# EAGLE board 612_jetracer_esp32s3_030004 (EAGLE 9.6.2)
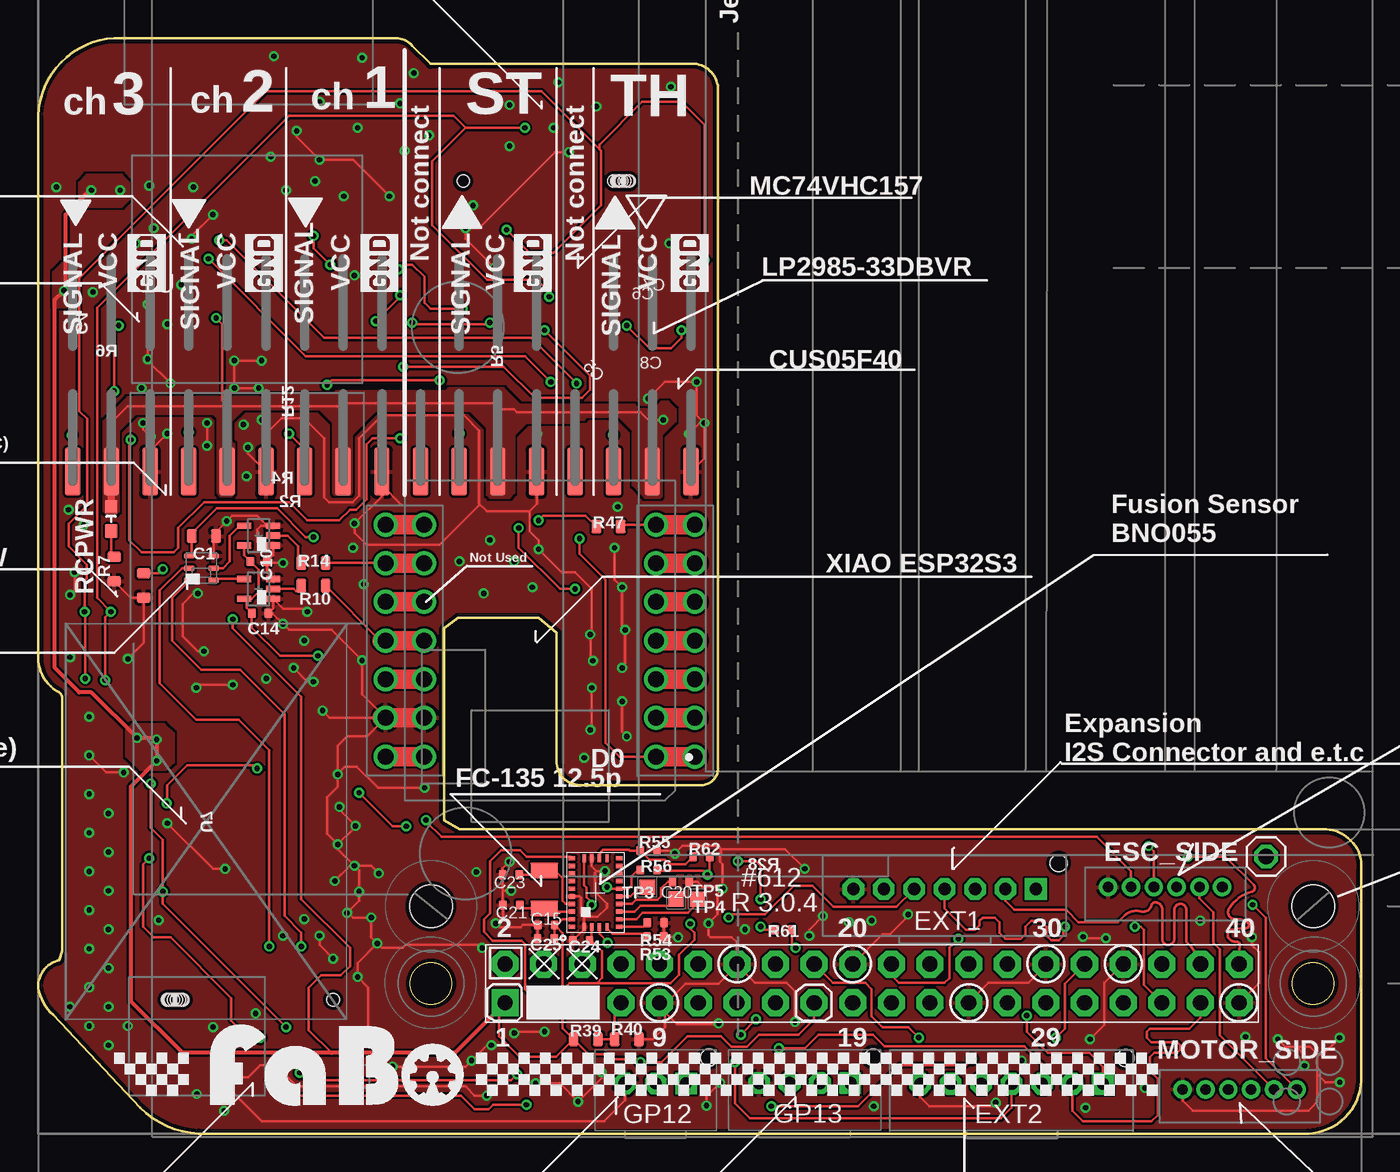
[diagram p5: board, top side]
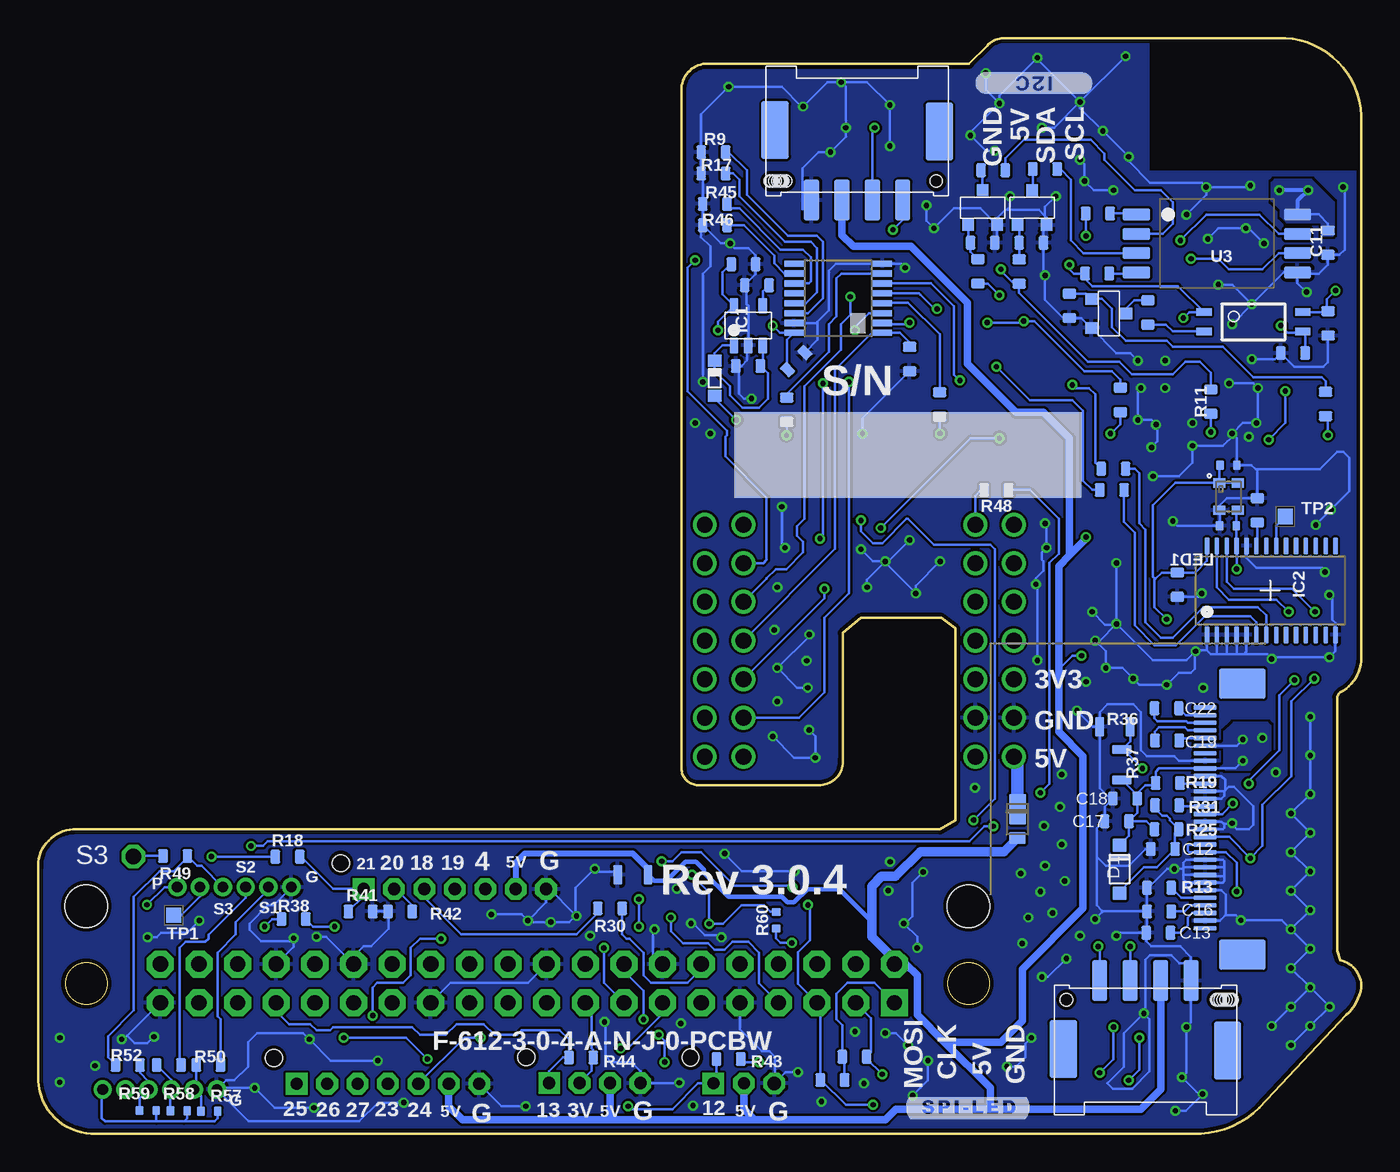
[diagram p6: board, bottom side, seen from below]

Size 87.01 x 72 mm. Coordinates in mm from the lower left corner, seen from the top.
Outline: 44.71,24.1 44.71,68.4 arc84 43.31,70.3 25.81,70.3 24.61,71.5 arc50 23.41,72 5.51,72 arc90 0.01,66.9 0.01,31.5 arc67 1.41,29 1.51,28.9 1.61,28.7 1.61,12 1.41,11.4 arc80 0.01,9.6 arc39 1.01,7.8 6.71,1.7 arc48 11.11,0 83.51,0 arc90 87.01,3.8 87.01,17.4 arc90 84.71,20 27.71,20 26.71,20.6 26.71,33.2 27.61,33.9 32.91,33.9 34.11,32.9 34.11,24.6 arc99 35.71,22.9 43.61,22.9 arc95 44.71,24.1
Copper layers (1*16): Top 0.035mm / dielectric 1.6mm / Bottom 0.035mm
Design rules "PCBway": minimum track width 6mil, minimum drill 12mil, track to track 6mil, track to pad 6mil, pad to pad 6mil, via to via 6mil, smd to smd 6mil, copper to edge 10mil, drill to drill 10mil, minimum pad ring 10mil, minimum via ring 6mil, stop-mask expansion 2mil, vias tented up to drill 100mil, thermal gap 8mil
Holes 2.8 mm at 83.84,14.95 25.84,14.94
tKeepout: area 1.5,7.4 to 20.4,33.3; area -2.5,41.7 to 45.4,72.2
bRestrict: area -0.8,63.3 to 13.9,85.7; 9 lines

## Footprints (pad centres in the part's own frame; a part is rotated, then mirrored left to right if it is on the bottom)
0603 = smd 0.65 x 0.9: 1 -0.8,0; 2 0.8,0
0402 = smd 0.5 x 0.6: 1 -0.55,0; 2 0.55,0
1N4148W = smd 0.9 x 0.95: ANODE 0,0; CATHODE 3.15,0
CUS05F40 = smd 0.8 x 0.9: A -1.15,0; C 1.15,0
US2H = smd 0.8 x 1.1: A 1.25,0 | smd 2 x 1.1: K -0.65,0
B6B-ZR = drill 0.7 pad 1.016: 1 -3.75,0; 2 -2.25,0; 3 -0.75,0; 4 0.75,0; 5 2.25,0; 6 3.75,0
SPI-B07B-PASK-1 = drill 0.8 pad 1.422 octagon: 1 -6,1.27; 2 -4,1.27; 3 -2,1.27; 4 0,1.27; 5 2,1.27; 6 4,1.27 | drill 0.8 pad 1.422 square: 7 6,1.27 | hole 1.1: 7.5,2.97
FABO_BRICK_3PIN_B03B-PASK-1 = drill 0.9 pad 1.422 octagon: GND -2,0 | drill 0.8 pad 1.422 square: I/O 2,0 | drill 0.8 pad 1.422 octagon: VCC 0,0 | hole 1.1: 3.5,1.7
GPIO-B04B-PASK-1 = drill 0.8 pad 1.422 octagon: 3V3 1,0.02; 5V -1,0.02; GND -3,0.02 | drill 0.8 pad 1.422 square: IO 3,0.02 | hole 1.1: 4.5,1.72
JETSON_NANO_DEMENTION = drill 1 pad 1.778 square: 1 0,0 | drill 1 pad 1.778 octagon: 2 0,2.54; 3 2.54,0; 4 2.54,2.54; 5 5.08,0; 6 5.08,2.54; 7 7.62,0; 8 7.62,2.54; 9 10.16,0; 10 10.16,2.54; 11 12.7,0; 12 12.7,2.54; 13 15.24,0; 14 15.24,2.54; 15 17.78,0; 16 17.78,2.54; 17 20.32,0; 18 20.32,2.54; 19 22.86,0; 20 22.86,2.54; 21 25.4,0; 22 25.4,2.54; 23 27.94,0; 24 27.94,2.54; 25 30.48,0; 26 30.48,2.54; 27 33.02,0; 28 33.02,2.54; 29 35.56,0; 30 35.56,2.54; 31 38.1,0; 32 38.1,2.54; 33 40.64,0; 34 40.64,2.54; 35 43.18,0; 36 43.18,2.54; 37 45.72,0; 38 45.72,2.54; 39 48.26,0; 40 48.26,2.54
I2C-SM04B-PASS-1-FL = smd 1 x 2.7: 5V -1,0; GND -3,0; SCL 3,0; SDA 1,0 | smd 1.8 x 3.8: P$5 -5.4,4.6; P$6 5.4,4.5 | hole 0.8: 5.2,1.25; -4.7,1.25; -5.7,1.25; -5.6,1.25; -5.4,1.25; -5.2,1.25; -5.1,1.25; -5,1.25; -4.9,1.25
SOT-23-5 = smd 0.6 x 1.05: 1 -0.95,-1.3; 2 0,-1.3; 3 0.95,-1.3; 4 0.95,1.3; 5 -0.95,1.3
PCA9685 = smd 0.3 x 1.1: 1 -4.15,-2.93; 2 -3.5,-2.93; 3 -2.85,-2.93; 4 -2.2,-2.93; 5 -1.55,-2.93; 6 -0.9,-2.93; 7 -0.25,-2.93; 8 0.4,-2.93; 9 1.05,-2.93; 10 1.7,-2.93; 11 2.35,-2.93; 12 3,-2.93; 13 3.65,-2.93; 14 4.3,-2.93; 15 4.3,2.92; 16 3.65,2.92; 17 3,2.92; 18 2.35,2.92; 19 1.7,2.92; 20 1.05,2.92; 21 0.4,2.92; 22 -0.25,2.92; 23 -0.9,2.92; 24 -1.55,2.92; 25 -2.2,2.92; 26 -2.85,2.92; 27 -3.5,2.92; 28 -4.15,2.92
APA102_2020 = smd 0.7 x 0.35: CKI 0.8,0; CKO -0.8,0; GND 0.8,0.8; SDI 0.8,-0.8; SDO -0.8,-0.8; VCC -0.8,0.8
SUPERSOT-3 = smd 0.76 x 0.76: D 0,1.15; G -0.95,-1.15; S 0.95,-1.15
0805 = smd 0.6 x 1.3: 1 -1,0; 2 1,0
0603' = smd 0.9 x 0.8: ANODE -0.8,0; CATHODE 0.8,0
1X01 = drill 1.016 octagon: 1 0,0
SPI-SM04B-PASS-1-FL = smd 1 x 2.7: 5V -1,-0.1; CI 1,-0.1; DI 3,-0.1; GND -3,-0.1 | smd 1.8 x 3.8: P$5 -5.4,4.5; P$6 5.4,4.4 | hole 0.8: 5.2,1.15; -4.7,1.15; -5.7,1.15; -4.8,1.15; -4.9,1.15; -5.1,1.15; -5.3,1.15; -5.5,1.15; -5.6,1.15
TESTPOINT_SMD-10SN = smd 1 x 1: TP 0,0
11-3C1 = smd 1 x 0.5: 1 -3.24,0.635; 2 -3.24,-0.635; 3 3.24,-0.635; 4 3.24,0.635
MOUDLE14P-DIP = drill 1.05: P$1 1.27,18.12; P$2 1.27,15.58; P$3 1.27,13.04; P$4 1.27,10.5; P$5 1.27,7.96; P$6 1.27,5.42; P$7 1.27,2.88; P$8 16.51,2.88; P$9 16.51,5.42; P$10 16.51,7.96; P$11 16.51,10.5; P$12 16.51,13.04; P$13 16.51,15.58; P$14 16.51,18.12; P$15 -1.27,18.12; P$16 -1.27,15.58; P$17 -1.27,13.04; P$18 -1.27,10.5; P$19 -1.27,7.96; P$20 -1.27,5.42; P$21 -1.27,2.88; P$22 19.05,2.88; P$23 19.05,5.42; P$24 19.05,7.96; P$25 19.05,10.5; P$26 19.05,13.04; P$27 19.05,15.58; P$28 19.05,18.12
TLP2270 = smd 0.8 x 1.8: 1 -1.905,-5.3; 2 -0.635,-5.3; 3 0.635,-5.3; 4 1.905,-5.3; 5 1.905,5.3; 6 0.635,5.3; 7 -0.635,5.3; 8 -1.905,5.3
ER-CON30HT-1 = smd 0.3 x 1.5 bottom: 1 7,-0.23; 2 6.5,-0.23; 3 6,-0.23; 4 5.5,-0.23; 5 5,-0.23; 6 4.5,-0.23; 7 4,-0.23; 8 3.5,-0.23; 9 3,-0.23; 10 2.5,-0.23; 11 2,-0.23; 12 1.5,-0.23; 13 1,-0.23; 14 0.5,-0.23; 15 0,-0.23; 16 -0.5,-0.23; 17 -1,-0.23; 18 -1.5,-0.23; 19 -2,-0.23; 20 -2.5,-0.23; 21 -3,-0.23; 22 -3.5,-0.23; 23 -4,-0.23; 24 -4.5,-0.23; 25 -5,-0.23; 26 -5.5,-0.23; 27 -6,-0.23; 28 -6.5,-0.23; 29 -7,-0.23; 30 -7.5,-0.23 | smd 2 x 3 bottom: 31 -9.07,-2.67; 32 8.74,-2.67
PNHEADER_2.54_SMT_17PIN_RC_TT01_02 = smd 1.02 x 3.17: 1:SIGNAL3 -20.32,0; 2:VCC3 -17.78,0; 3:GND3 -15.24,0; 4:SIGNAL2 -12.7,0; 5:VCC2 -10.16,0; 6:GND2 -7.62,0; 7:SIGNAL1 -5.08,0; 8:VCC1 -2.54,0; 9:GND1 0,0; 10:NC1 2.54,0; 11:ST_SIGNAL 5.08,0; 12:ST_VCC 7.62,0; 13:ST_GND 10.16,0; 14:NC2 12.7,0; 15:TH_SINGNAL 15.24,0; 16:TH_VCC 17.78,0; 17:TH_GND 20.32,0
MC74VHC157_TSSOP-16 = smd 1.26 x 0.36: 1 -2.9,2.275; 2 -2.9,1.625; 3 -2.9,0.975; 4 -2.9,0.325; 5 -2.9,-0.325; 6 -2.9,-0.975; 7 -2.9,-1.625; 8 -2.9,-2.275; 9 2.9,-2.275; 10 2.9,-1.625; 11 2.9,-0.975; 12 2.9,-0.325; 13 2.9,0.325; 14 2.9,0.975; 15 2.9,1.625; 16 2.9,2.275
SOT-1DOT1 = smd 0.4 x 0.95: 1 -0.65,-0.95; 2 0,-0.95; 3 0.65,-0.95; 4 0.65,0.95; 5 -0.65,0.95
KC2016Z = smd 0.6 x 0.8: #1 -0.9,-0.6; #2 0.9,-0.6; #3 0.9,0.6; #4 -0.9,0.6
LGA = smd 0.25 x 0.475: 1 -2.25,1.562; 6 -2.25,-1.562; 7 -1.75,-1.562; 8 -1.25,-1.562; 9 -0.75,-1.562; 10 -0.25,-1.562; 11 0.25,-1.562; 12 0.75,-1.562; 13 1.25,-1.562; 14 1.75,-1.562; 15 2.25,-1.562; 20 2.25,1.562; 21 1.75,1.562; 22 1.25,1.562; 23 0.75,1.562; 24 0.25,1.562; 25 -0.25,1.562; 26 -0.75,1.562; 27 -1.25,1.562; 28 -1.75,1.562 | smd 0.475 x 0.25: 2 -2.263,0.75; 3 -2.263,0.25; 4 -2.263,-0.25; 5 -2.263,-0.75; 16 2.263,-0.75; 17 2.263,-0.25; 18 2.263,0.25; 19 2.263,0.75
FC-135 = smd 1 x 1.8: 1 -1.25,0; 2 1.25,0

## Placement (x,y rotation side)
C1  10uF  [0603]  10.91,39.27 180 top
C2  0.1uF  [0603]  12.1,36.07 90 bottom
C3  20pF  [0402]  8.78,39.94 0 bottom
C4  0.1uF  [0603]  2.21,53.25 90 bottom
C5  0.1uF  [0603]  37.17,50.77 225 bottom
C6  0.01uF  [0603]  39.75,55.76 0 bottom
C7  2.2uF  [0603]  40.63,57.13 180 bottom
C8  1uF  [0603]  40.33,50.44 0 bottom
C9  10uF  [0402]  8.75,43.93 180 bottom
C10  0.1uF  [0402]  14.51,37.6 180 top
C11  0.1uF  [0603]  2.21,58.55 90 bottom
C12  10uF  [0603]  13.06,18.7 0 bottom
C13  10uF  [0603]  13.36,13.2 0 bottom
C14  0.1uF  [0402]  14.61,34.2 180 top
C15  0.1uF  [0402]  33.41,13.71 0 top
C16  10uF  [0603]  13.31,14.6 0 bottom
C17  1uF  [0603]  16.09,20.53 0 bottom
C18  1uF  [0603]  15.55,22.02 0 bottom
C19  1uF  [0603]  12.78,25.83 180 bottom
C20  0.1uF  [0402]  42.27,16.55 180 top
C21  22pF  [0402]  31.12,15.02 180 top
C22  1uF  [0603]  12.81,27.95 0 bottom
C23  22pF  [0402]  31.1,17 180 top
C24  0.1uF  [0402]  35.71,12.68 0 top
C25  0.1uF  [0402]  33.4,12.8 0 top
D1  1N4148  [1N4148W]  15.91,15.8 90 bottom
D2  CUS05F40  [CUS05F40]  42.52,49.65 90 bottom
D3  CUHS20S30  [US2H]  22.62,20.67 270 bottom
ESC_CON  BRUSHLESSMOTOR_CON  [B6B-ZR]  74.11,16.2 0 top
EXT1  FABO-I2S-7PIN  [SPI-B07B-PASK-1]  59.61,14.8 0 top
EXT2  FABO-SPI-7PIN  [SPI-B07B-PASK-1]  64.01,2 0 top
GP12  [FABO_BRICK_3PIN_B03B-PASK-1]  40.61,3.3 0 top
GP13  FABO-GPIO-2G  [GPIO-B04B-PASK-1]  50.41,3.3 0 top
GPIO40  JETSON_NANOJETSON_NANO_OVERALL  [JETSON_NANO_DEMENTION]  30.71,8.6 0 top
I2C  FABO-I2C  [I2C-SM04B-PASS-1-FL]  33.16,61.35 0 bottom
IC1  [SOT-23-5]  40.31,53.1 0 bottom
IC2  [PCA9685]  6.01,35.7 0 bottom
LED1  [APA102_2020]  10.75,37.16 0 top
MOTOR  BRUSHLESSMOTOR_CON  [B6B-ZR]  79.01,2.9 0 top
Q3  MOSFET-N_FDN335N  [SUPERSOT-3]  16.61,53.9 270 bottom
Q4  MOSFET-N_FDN335N  [SUPERSOT-3]  21.66,60.85 0 bottom
Q5  MOSFET-N_FDN335N  [SUPERSOT-3]  24.91,60.85 0 bottom
R1  DNP  [0603]  6.95,36.03 90 top
R2  220  [0603]  16.41,42.3 180 bottom
R3  0  [0603]  6.86,40.96 270 bottom
R4  220  [0603]  16.31,43.7 180 bottom
R5  100K  [0603]  29.71,50.9 90 bottom
R6  4.7K  [0603]  4.51,51.3 180 bottom
R7  1K  [0603]  5.01,37.1 90 top
R8  470  [0603]  2.36,47.95 270 bottom
R9  10K  [0603]  42.61,64.5 0 bottom
R10  0  [0603]  18.11,36 180 top
R11  22  [0603]  9.91,48.1 90 bottom
R12  22  [0603]  15.86,48.22 90 bottom
R13  390K  [0603]  13.31,16.15 180 bottom
R14  0  [0603]  18.11,37.5 180 top
R15  330  [0603]  17.38,56.52 180 bottom
R16  330  [0603]  17.33,60.47 180 bottom
R17  10K  [0603]  42.61,63.1 0 bottom
R18  51  [0603]  70.61,18.2 0 bottom
R19  10K  [0603]  12.74,23.03 0 bottom
R20  27  [0603]  27.73,47.92 270 bottom
R21  27  [0603]  37.78,47.57 270 bottom
R22  DNF  [0603]  34.78,3.52 0 bottom
R23  DNF  [0603]  33.34,5.05 180 bottom
R24  100K  [0603]  19.21,54.4 270 bottom
R25  10K  [0603]  12.81,20 0 bottom
R26  180  [0603]  14.05,53.96 90 bottom
R27  330  [0603]  20.81,63.4 180 bottom
R28  510  [0805]  47.91,17 0 bottom
R29  330  [0603]  24.22,63.31 180 bottom
R30  51  [0603]  49.41,14.8 180 bottom
R31  100  [0603]  12.78,21.58 0 bottom
R32  100K  [0603]  24.91,58.55 0 bottom
R33  100K  [0603]  21.71,58.55 0 bottom
R34  470  [0603]  25.21,56.67 90 bottom
R35  470  [0603]  22.51,56.65 90 bottom
R36  0/0805  [0805]  16.21,26.75 0 bottom
R37  DNP  [0805]  15.76,24.25 270 bottom
R38  51  [0603]  70.21,14.1 0 bottom
R39  DNF  [0603]  36.01,6.2 0 top
R40  DNF  [0603]  38.71,6.2 0 top
R41  100K  [0603]  65.81,14.6 0 bottom
R42  100K  [0603]  63.21,14.6 180 bottom
R43  DNF  [0603]  41.61,4.9 180 bottom
R44  DNF  [0603]  51.31,5 180 bottom
R45  10K  [0603]  42.51,61.1 0 bottom
R46  10K  [0603]  42.51,59.7 0 bottom
R47  0  [0603]  37.51,39.9 0 top
R48  0  [0603]  24.01,42.3 180 bottom
R49  0  [0603]  77.99,18.25 180 bottom
R50  0  [0603]  75.81,4.5 0 bottom
R51  0  [0603]  78.41,4.5 0 bottom
R52  0  [0603]  81.11,4.5 180 bottom
R53  10K  [0402]  40.59,12.94 180 top
R54  10K  [0402]  40.61,13.86 180 top
R55  10K  [0402]  40.15,18.6 180 top
R56  10K  [0402]  40.15,17.32 0 top
R57  DNP  [0402]  75.75,1.47 0 bottom
R58  DNP  [0402]  77.76,1.51 0 bottom
R59  DNP  [0402]  79.79,1.52 0 bottom
R60  10K  [0402]  38.48,14.02 90 bottom
R61  10K  [0402]  49.01,13.4 180 top
R62  DNP  [0402]  43.61,18.2 0 top
RCPWR  ORANGE  [0603']  4.81,40.4 270 top
S3  [1X01]  80.74,18.21 0 top
SPI-LED  [SPI-SM04B-PASS-1-FL]  14.21,9.95 180 bottom
TP1  TESTPOINT_TPS-SMD-10SN  [TESTPOINT_SMD-10SN]  78.1,14.35 0 bottom
TP2  TESTPOINT_TPS-SMD-10SN  [TESTPOINT_SMD-10SN]  5.01,40.56 0 bottom
TP3  TESTPOINT_TPS-SMD-10SN  [TESTPOINT_SMD-10SN]  40.05,16.2 0 top
TP4  TESTPOINT_TPS-SMD-10SN  [TESTPOINT_SMD-10SN]  43.36,15.41 0 top
TP5  TESTPOINT_TPS-SMD-10SN  [TESTPOINT_SMD-10SN]  41.94,15.42 0 top
U1  TLP291A  [11-3C1]  7.11,53.35 0 bottom
U2  [MOUDLE14P-DIP]  41.91,42.9 180 top
U3  [TLP2270]  9.51,58.5 270 bottom
U7  [ER-CON30HT-1]  10.51,20.5 270 top
U$1  RC_17PIN_OUTIN  [PNHEADER_2.54_SMT_17PIN_RC_TT01_02]  22.61,43.5 0 top
U$2  [LOGO_FABO_L]  18.96,1.84 0 top
U$3  MC74VHC157  [MC74VHC157_TSSOP-16]  34.4,54.9 180 bottom
U$5  [LOGO_SILK_GND]  16.11,55.3 90 top
U$6  [LOGO_SILK_GND]  23.71,55.3 90 top
U$7  [LOGO_SILK_GND]  33.81,55.3 90 top
U$8  [LOGO_SILK_GND]  44.11,55.3 90 top
U$9  SN74AHCT1G125  [SOT-1DOT1]  14.51,35.8 90 top
U$10  SN74AHCT1G125  [SOT-1DOT1]  14.51,39.3 90 top
U$11  KC2016Z  [KC2016Z]  8.74,41.86 270 bottom
U$12  [LOGO_SILK_GND]  8.41,55.3 90 top
U$13  BNO055  [LGA]  36.66,15.84 90 top
X1  FC-135  [FC-135]  33.29,16.05 90 top

## Tracks (layer width: path | path; a pad name or v marks a point on that pad's centre or on a via)
3V3_JETSON  (via drill 0.35)
  Top 0.152: GPIO40.1 30.31,8.2 30.31,6.4 31.66,5.05 34.06,5.05 R39.1 | v12.81,33.8 12.81,33.2 17.31,28.7 17.31,15.4 20.51,12.2 20.51,11 19.91,10.4 18.61,10.4 17.81,9.6 17.81,6.8 19.31,5.3 | R39.1 36.21,5.2 37.21,5.2 37.51,4.9 39.41,4.9 v39.61,4.7 41.01,4.7 42.71,6.4 44.91,6.4 45.61,5.7 46.61,5.7 47.41,6.5 50.01,6.5 51.03,7.52 GPIO40.17 | C15.2 34.12,13.71 34.5,14.09 U$13.28 | C15.2 34.05,13.62 | 34.05,13.62 34.49,13.18 34.49,9.41 | R39.1 34.49,6.92 34.49,9.41 | 34.49,9.41 34.96,9.88 36.75,9.88 | 36.75,9.88 41.6,9.88 42.16,10.44 42.16,11.76 43.15,12.75 43.15,13.2 42.88,13.46 v42.88,13.79 | 33.95,13.51 34.05,13.62 | C25.2 C15.2 | 36.75,9.88 37.1,10.23 37.1,11.97 36.39,12.68 C24.2 36.41,12.83 U$13.3 | 43.91,17.11 43.76,17.26 40.76,17.26 R56.2 | 43.91,17.11 v44.02,17.01 | R62.2 44.16,17.35 43.91,17.11
  Top 0.254: GPIO40.1 27.41,5.3 19.31,5.3 9.5,5.3 6.11,8.7 6.11,22.8 v7.81,24.5 v7.81,25.9 7.71,26 v6.51,26 3.51,29 2.71,29 1.11,30.6 1.11,54.8 v1.71,55.4 1.81,55.5 1.81,60.4 3.46,62.05 v3.51,62
  Bottom 0.152: U3.8 2.81,60.41 2.21,59.8 C11.2 | 3.83,54.02 U1.4 2.27,53.99 | R22.2 33.98,4.9 R23.2 34.14,7.13 34.51,7.5 34.51,9.2 33.81,9.9 32.01,9.9 GPIO40.1 | U$11.#4 U$11.#1 | C9.2 9.34,43.89 U$11.#1 | 2.27,53.99 C4.2 | IC2.28 10.16,37.65 10.93,36.87 C2.2 13.13,36.87 13.56,36.45 | v7.81,25.9 8.21,25.5 U7.25 | v7.81,24.5 8.31,24 U7.22 13.31,24 13.54,23.77 R19.1 13.67,22.9 14.21,22.9 14.75,22.36 C18.2 | v1.71,55.4 2.27,54.84 2.27,53.99 | v12.81,33.8 13.61,34.6 13.61,36.4 13.56,36.45 | U$11.#1 12.25,42.76 13.71,41.3 13.71,36.6 13.56,36.45 | R37.2 14.75,22.24 C18.2 | C17.2 14.75,21.07 C18.2 | R25.1 14.14,20.53 C17.2 | D1.CATHODE 15.29,19.57 C17.2 | R43.1 40.61,4.7 v39.61,4.7 | GPIO40.17 50.63,8.2 50.63,5.62 50.51,5.5 R44.1 50.61,4.9 50.61,4.12 GP13.3V3 | v44.02,17.01 42.88,15.87 v42.88,13.79 41.97,13.79 40.76,14.99 39.28,14.99 38.86,14.57 R60.2
  Bottom 0.254: U3.8 4.21,61.3 v3.51,62 v5.41,62
  pour Bottom (no thermals): 6.01,25.2 6.01,26.8 6.21,27 8.41,27 9.01,26.4 9.01,25.8 9.21,25.6 9.61,25.6 9.61,25.4 9.01,25.4 9.01,24.3 9.21,24.1 9.11,24 9.01,24 8.91,23.9 7.31,23.9
  pour Bottom (no thermals): 1.81,59.1 1.81,61.2 3.31,62.7 5.71,62.7 5.91,62.5 5.91,61.3 5.31,60.7 5.31,60.3 4.91,59.9 2.71,59.9 2.61,59.8 2.61,59 1.91,59
  pour Top (no thermals): 2.71,61.1 2.71,62.5 3.21,63 5.51,63 6.01,62.5 6.01,61.4 5.51,60.9 2.91,60.9
  pour Top (no thermals): 1.01,54.4 1.01,56.6 1.61,57.2 1.81,57.2 2.31,56.7 2.31,54.8 1.81,54.3 1.11,54.3
  pour Top (no thermals): 5.81,24.8 5.81,26.5 6.21,26.9 8.31,26.9 8.91,26.3 8.91,24.4 8.41,23.9 6.71,23.9
5V_JETSON  (via drill 0.35)
  Top 0.152: LED1.VCC 10.11,38.12 C1.2 10.11,39.47 11.74,41.1 15.71,41.1 17.61,39.2 v18.11,39.2 | 13.71,35.15 14.06,35.15 14.51,35.6 14.51,37.05 C10.2 13.56,38 U$10.5 | 13.71,35.15 U$9.5 | 13.71,35.15 13.71,34.55 C14.2 14.06,33.25 15.91,31.4 v18.41,31.4
  Bottom 0.152: v18.11,39.2 18.21,39.2 18.21,39 | v18.41,31.4 19.01,31.4 19.91,30.5
  Bottom 0.305: 32.19,13.93 34.31,16.06 36.44,16.06 37.3,15.2 37.73,15.2 38.1,15.57 41.63,15.57 43.22,17.16 43.22,17.34 43.74,17.87 44.44,17.87 45.71,16.6 46.51,16.6 R28.2
  Bottom 0.406: R28.2 46.91,17.4 47.91,18.4 55.01,18.4 55.61,17.8 EXT1.2
  Bottom 0.508: 19.21,38 19.21,45.7 20.91,47.4 22.71,47.4 25.91,50.6 25.91,54.6 29.61,58.3 33.41,58.3 34.16,59.05 I2C.5V | 19.21,38 19.91,37.3 19.91,30.5 19.91,26.4 18.31,24.8 18.31,14.8 22.31,10.8 22.31,7.4 23.71,6 27.41,6 | 19.21,38 18.21,39 | GPIO40.2 30.91,11.14 | SPI-LED.5V 13.21,2.9 14.51,1.6 24.41,1.6 | 30.41,11.14 29.95,11.14 29.21,10.4 29.21,7.8 27.41,6 | 30.41,11.14 GPIO40.2 | 24.41,1.6 30.61,1.6 31.31,0.9 39.91,0.9 | GP12.VCC 40.61,1.6 39.91,0.9 | 39.91,0.9 49.01,0.9 | 49.01,0.9 59.11,0.9 60.01,1.8 EXT2.2 | 27.41,6 24.41,3 24.41,1.6 | GP13.5V 49.41,1.3 49.01,0.9 | 30.59,11.32 30.41,11.14 | GPIO40.2 30.71,11.32
  Bottom 0.61: 30.59,11.32 32.19,12.92 32.19,13.93 32.19,16.26 31.55,16.9 30.63,16.9 29,18.53 23.51,18.53 D3.A
5VL_JETSON
  Top 1.27: U2.P$14 U2.P$28
  Bottom 0.813: D3.K 22.62,24.54 U2.P$28
AI_CH1_ST  (via drill 0.35)
  Top 0.152: v24.01,50.4 30.61,50.4 32.66,48.34 35.75,48.34 36.31,48.9 36.31,49.8 v33.31,52.8
  Bottom 0.152: R2.2 17.71,42.3 18.31,42.9 18.31,47.5 19.01,48.2 21.81,48.2 v24.01,50.4 | v33.31,52.8 33.31,53 32.39,53.92 U$3.3
AI_CH2_TH  (via drill 0.35)
  Top 0.152: v26.41,49.5 19.31,49.5 v19.01,49.2
  Bottom 0.152: U$3.6 31.47,55.9 28.31,55.9 26.79,54.38 26.79,49.88 v26.41,49.5 | v19.01,49.2 18.81,49 17.91,49 17.51,48.6 17.51,44.1 R4.2
BEC_3V3  (via drill 0.35)
  Top 0.152: v42.31,52.8 42.31,52.3 41.61,51.6 40.21,51.6 v38.71,53.1
  Bottom 0.152: v38.71,53.1 38.23,52.62 U$3.16 37.77,52.16 37.77,50.24 C5.2 | v42.31,52.8 42.31,53.35 IC1.5 42.01,55.15 42.01,56.61 41.48,57.13 C7.2
BEC_60
  Bottom 0.152: 39.21,51.8 IC1.3 39.36,50.61 C8.2 39.48,50.44 39.01,49.97 39.01,48.3 39.61,47.7 40.71,47.7 41.52,48.51 41.52,49.11 42.52,50.11 D2.C 42.52,51.29 42.01,51.8 IC1.1 41.26,51.7
BEC_62  (via drill 0.35)
  Top 0.152: U$1.2:VCC3 4.83,46.72 5.91,47.8 12.11,47.8 | 12.11,47.8 12.51,47.8 | 12.51,47.8 19.71,47.8 19.76,47.75 | 30.23,47.6 31.31,47.6 31.51,47.4 39.61,47.4 40.39,46.62 40.39,46.5 | 40.39,46.5 U$1.16:TH_VCC | 19.76,47.75 20.07,47.44 U$1.8:VCC1 | 40.39,46.5 40.79,46.9 v41.11,46.9 | v18.11,59 18.11,58.2 v19.21,57.1 | v11.71,53.6 12.11,53.2 12.11,48.2 12.51,47.8 | 30.23,47.6 30.23,47.78 30.01,48 20.01,48 19.76,47.75 | U$1.12:ST_VCC 30.23,47.6 | 12.11,47.8 12.45,47.46 U$1.5:VCC2
  Top 0.508: U$1.2:VCC3 4.83,41.22 RCPWR.ANODE
  Bottom 0.152: v41.11,46.9 42.52,48.31 D2.A | R16.2 18.11,60.45 v18.11,59 | v19.21,57.1 19.21,56.8 18.91,56.5 18.2,56.5 R15.2 18.18,56.18 17.71,55.7 12.06,55.7 U1.1 11.32,53.99 v11.71,53.6
  pour Top (no thermals): 4.31,46.8 4.31,40.9 4.51,40.7 5.11,40.7 5.31,40.9 5.31,46.2 6.41,47.3 11.51,47.3 11.81,47 11.81,42.1 12.01,41.9 12.71,41.9 12.91,42.1 12.91,45.3 12.71,45.5 12.71,46.8 13.51,47.6 18.51,47.6 19.41,46.7 19.41,42.1 19.51,42 20.51,42 20.61,42.1 20.61,45.9 22.21,47.5 28.41,47.5 29.51,46.4 29.51,42 29.71,41.8 31.01,41.8 31.31,42.1 31.31,45.9 32.11,46.7 35.11,46.7 35.31,46.9 35.91,46.9 36.11,47.1 38.21,47.1 39.11,46.2 39.11,42.6 39.91,41.8 40.91,41.8 41.01,41.9 41.01,45.9 41.91,46.8 41.91,47.6 41.41,48.1 41.01,48.1 40.51,47.6 39.51,47.6 39.21,47.9 31.71,47.9 30.61,49 27.01,49 26.81,48.8 19.61,48.8 19.41,48.6 15.21,48.6 15.01,48.4 5.91,48.4
BNO_RESET  (via drill 0.35)
  Top 0.152: R61.2 47.71,13.4 v47.51,13.6 | v46.01,17.9 47.21,17.9 47.51,17.6 v47.51,15.4 | v37.41,16.2 37.52,16.09 U$13.11 38.8,16.09 39.01,16.3 39.01,16.9 39.43,17.32 R56.1
  Bottom 0.152: v47.51,13.6 v47.51,15.4 | v46.01,17.9 45.31,17.9 44.71,18.5 43.41,18.5 41.21,16.3 37.51,16.3 v37.41,16.2
CLK2  (via drill 0.35)
  Top 0.152: LED1.CKO 9.47,37.16 8.01,35.7 8.01,29.6 10.41,27.2 13.21,27.2 15.21,25.2 v15.21,12.3
  Bottom 0.152: SPI-LED.CI v15.21,12.3
CLK_HV
  Top 0.152: LED1.CKI 12.17,37.16 12.61,37.6 12.61,39.3 13.26,39.95 U$10.4
CLK_LV
  Top 0.152: R14.2 17.11,37.7 17.11,38.6 16.41,39.3 U$10.2
ESP32_3V3
  Top 1.27: U2.P$12 U2.P$26
G18
  Bottom 0.152: R30.2 50.21,14.5 51.61,13.1 59.21,13.1 61.61,15.5 EXT1.5
G19  (via drill 0.35)
  Top 0.152: EXT1.4 59.61,14.8 61.01,13.4 61.61,13.4 61.91,13.7 61.91,14 62.11,14.2 62.91,14.2 63.21,13.9 63.21,13.2 63.61,12.8 64.61,12.8 64.91,13.1 64.91,13.6 65.31,14 65.91,14 66.31,13.6 66.31,13 66.61,12.7 67.11,12.7 67.41,13 67.41,13.5 v67.51,13.6
  Bottom 0.152: R38.2 68.91,13.6 v67.51,13.6
G21
  Bottom 0.152: R18.2 69.71,18.2 67.61,16.1 65.64,16.1 EXT1.7 65.61,15.6 R41.1
GND  (via drill 0.35)
  Top 0.152: LED1.GND 11.55,39.11 C1.1 11.71,39.55 v12.41,40.25 12.76,40.6 14.41,40.6 15.06,39.95 U$10.3 14.66,39.95 14.41,39.7 14.41,38.9 14.66,38.65 U$10.1 15.46,38 C10.1 15.06,37.55 | v32.81,46 32.81,43.54 | 32.81,43.54 U$1.13:ST_GND | GPIO40.9 41.33,8.6 42.57,9.84 44.75,9.84 45.95,11.04 45.95,11.1 | 45.95,11.1 GPIO40.14 45.95,12.56 45.61,12.9 44.21,12.9 44.07,13.03 v44.07,13.81 | GPIO40.25 62.49,9.9 65.11,9.9 66.27,11.06 GPIO40.30 | 71.35,10.54 GPIO40.34 70.11,9.9 70.11,7.14 v69.17,6.2 | R1.1 6.72,35 | R7.1 6.08,35.23 R1.1 | R1.1 6.95,32.24 v5.91,31.2 | v7.21,54.5 v7.21,50.9 7.21,50.8 v8.71,49.3 | v8.51,46 7.41,44.9 7.37,44.9 U$1.3:GND3 | v34.91,64.5 34.01,64.5 29.01,59.5 v28.11,59.5 28.11,58.8 v30.01,56.9 | v40.11,48.3 41.21,49.4 v43.31,49.4 43.31,47.2 v43.81,46.7 | v43.81,46.7 43.81,44.38 U$1.17:TH_GND | U$1.9:GND1 22.61,42.1 | U2.P$27 21.31,28.87 v21.31,31.1 19.31,33.1 16.51,33.1 v16.11,33.5 15.41,34.2 C14.1 15.46,34.5 U$9.1 16.11,34.5 17.51,34.5 v17.71,34.3 | U2.P$27 22.61,27.32 19.19,27.32 v18.71,27.8 | U2.P$27 21.64,26.1 20.31,26.1 19.71,25.5 19.71,23.68 | 29.01,41.4 29.51,40.9 32.31,40.9 | 32.81,43.54 32.81,41.4 32.31,40.9 | 29.01,41.4 29.01,46.2 28.01,47.2 22.61,47.2 21.11,45.7 21.11,41.91 20.68,41.49 19.15,41.49 18.81,41.83 18.81,45.7 17.51,47 16.01,47 14.99,45.98 U$1.6:GND2 13.81,44.68 v13.81,45.1 | 11.01,31.7 v10.91,31.7 10.51,31.7 9.51,32.7 9.51,34.8 10.21,35.5 v10.51,35.5 | v14.71,50.8 v12.91,50.8 v12.91,49 v14.51,49 | 29.01,41.4 29.01,41.3 26.41,38.7 21.61,38.7 20.81,39.5 v20.81,40.1 22.61,41.9 U$1.9:GND1 | v2.41,36.9 2.41,35.7 v2.11,35.4 | v23.11,61.6 20.71,64 v18.51,64 17.01,65.5 v17.01,65.9
  Top 0.152: v8.51,20.4 11.51,17.4 v12.31,17.4 | v57.21,14.4 57.26,14.35 56.01,13.1 55.53,13.1 GPIO40.20 | v11.11,46.7 v11.11,45.2 | v7.41,45.8 6.91,46.3 v6.91,46.7 | U$1.9:GND1 22.61,42.6 23.91,41.3 | v5.64,23.74 4.48,23.74 v3.37,24.85 | v10.11,58.8 10.11,59 v11.51,60.4 | v21.71,6.3 21.71,9.6 v21.01,10.3 21.01,11.2 v22.31,12.5 | v23.31,4.4 28.11,4.4 v28.51,4.8 29.51,5.8 v29.81,5.8 | v38.41,30.6 38.61,30.8 v38.61,33.1 38.41,33.3 v38.41,35.9 37.91,36.4 v37.91,38.5 | 36.33,32.82 36.41,32.9 36.41,35.8 35.31,36.9 34.41,36.9 v32.91,38.4 32.91,39 32.31,39.6 32.31,40.9 | 36.33,32.82 v36.31,32.8 | v18.11,29.7 17.71,29.7 v16.81,30.6 | v38.71,26.1 38.41,26.4 v38.41,28.4 | v10.41,29.3 10.61,29.5 v12.81,29.5 | v20.81,17.6 21.11,17.3 v21.11,15.9 21.11,15.3 v20.31,14.5 20.31,14.6 20.71,14.2 v21.91,14.2 21.91,12.9 v22.31,12.5 | v20.81,17.6 21.91,17.6 v22.41,17.1 22.51,17.2 | 19.71,23.68 v19.71,23.6 19.71,22.8 19.01,22.1 19.01,19.7 v19.71,19 | v19.71,19 19.71,18.7 v20.81,17.6 | v19.51,16.6 20.51,17.6 v20.81,17.6 | v42.81,46 43.51,46.7 v43.81,46.7 | v29.21,12.2 29.01,12.4 24.21,12.4 24.01,12.2 22.61,12.2 v22.31,12.5 | R40.2 40.41,6.2 41.21,7 41.21,8.26 GPIO40.9 | v68.71,12.94 68.81,12.84 v70.21,12.84 | v50.71,13 50.71,13.4 v51.61,14.3 | v19.41,11.5 18.51,12.4 v18.51,13 | v62.97,2.04 62.73,1.8 58.61,1.8 58.01,2.4 EXT2.1 | v44.75,7.24 44.71,7.2 42.01,7.2 40.87,8.34 GPIO40.9 | v49.76,7.34 49.76,9.34 49.21,9.9 47.15,9.9 45.95,11.1 | v31.31,6.6 31.41,6.7 v33.31,6.7 | v32.71,3.3 34.31,3.3 v35.51,2.1 37.05,3.64 v37.05,4.04 | GP12.GND 38.61,2.2 37.21,0.8 14.71,0.8 v11.81,3.7 13.81,3.7 14.61,4.5 15.61,4.5 17.01,3.1 28.11,3.1 28.71,2.5 v29.51,2.5
  Top 0.152: v43.95,1.84 43.95,2.44 v44.85,3.34 | v81.51,6.2 82.01,5.7 82.75,5.7 | 82.75,5.7 83.61,5.7 84.11,5.2 | 84.11,5.2 84.11,3.9 | 84.11,3.9 84.11,2.1 83.51,1.5 75.91,1.5 75.26,2.15 MOTOR.1 | R55.1 41.67,18.6 v41.87,18.4 42.37,18.9 44.71,18.9 44.91,18.7 | 35.91,14.28 U$13.2 35.91,13.43 C24.1 | U$13.25 35.6,15.59 35.7,15.49 35.7,14.49 35.91,14.28 | 35.91,14.28 35.95,14.24 36.79,14.24 37.41,14.86 37.41,15.12 36.62,15.9 36.62,17.15 36.72,17.25 v37.28,17.25 36.72,17.25 36.41,17.57 U$13.18 | 30.55,15.98 30.55,15.04 C21.2 30.57,14.29 v30.09,13.81 30.34,13.57 31.72,13.57 31.89,13.73 32.59,13.73 32.74,13.59 | 30.55,15.98 C23.2 30.55,17.43 v30.99,17.87 | C15.1 32.82,13.67 | 32.82,13.67 32.74,13.59 | 32.74,13.59 | v44.07,13.81 44.07,13.85 | 15.06,37.55 15.06,36.85 U$9.3 | v16.11,37.5 15.11,37.5 15.06,37.55 | 30.55,15.98 30.56,15.97 v31.11,15.97 | v83.26,4.46 83.26,5.19 82.75,5.7 | v85.59,3.37 84.64,3.37 84.11,3.9 | v85.58,6.3 84.48,5.2 84.11,5.2 | v36.41,29.3 36.41,26.62 v36.32,26.53 | 32.82,13.67 32.85,13.64 C25.1 | 41.16,13.99 R54.1 41.16,12.95 R53.1 41.91,12.94 41.92,12.93 42.02,12.93 42.07,12.88 v42.08,12.89 | C20.1 43.34,16.55 43.67,16.23 44.88,16.23 v45.01,16.1 | v44.07,13.81 44.67,14.41 44.67,15.77 v45.01,16.1 | v36.48,31.08 36.33,31.23 36.33,32.82 | v19.71,19 20.87,20.17 v20.87,20.22 19.82,21.27 v19.82,21.47 | v25.41,22.73 22.34,22.73 20.95,24.12 20.15,24.12 19.71,23.68 | v45.01,16.1 45.01,17.71 44.85,17.87 44.85,18.33 44.91,18.39 44.91,18.7 | 44.91,18.7 49.11,18.7 v50.41,17.4 | v79.81,12.9 79.81,12.38 80.28,11.9 80.28,9.92 GPIO40.39
  Top 1.27: U2.P$13 22.61,27.32
  Bottom 0.152: R5.1 32.81,47 v32.81,46 | R32.2 23.96,58.7 Q5.S | U3.5 4.11,56.5 2.81,56.5 2.21,57.1 C11.1 1.46,57.75 1.11,58.1 1.11,62.1 v1.21,62.2 | v12.41,40.25 12.1,39.94 C3.1 U$11.#2 9.34,41.27 8.85,41.76 R3.1 6.86,43.55 6.96,43.65 | IC2.5 7.56,31.65 7.71,31.5 | 7.71,31.5 8.21,31.5 | 8.21,31.5 8.81,31.5 | 8.81,31.5 9.41,31.5 | 9.41,31.5 9.91,31.5 10.16,31.75 | 10.16,31.75 IC2.1 | IC2.2 9.51,31.6 9.41,31.5 | IC2.3 8.86,31.55 8.81,31.5 | IC2.4 8.21,31.5 | 6.96,43.65 7.24,43.93 C9.1 8.2,45.69 8.41,45.9 | 7.71,31.5 6.21,31.5 v5.91,31.2 5.81,31.3 v2.11,31.3 1.71,31.7 IC2.14 1.71,33.57 1.91,33.77 1.91,35.2 v2.11,35.4 | C4.1 2.21,50.7 2.51,50.4 4.41,50.4 R6.2 5.71,50.9 v7.21,50.9 | v7.21,54.5 5.11,56.6 U3.5 | 8.41,45.9 v8.51,46 7.81,46.7 v6.91,46.7 6.81,46.8 v6.81,49 7.11,49.3 v8.71,49.3 | Q5.S 23.96,60.15 23.41,60.7 23.31,60.7 | 20.81,60.3 20.71,60.2 Q4.S 20.91,59.5 R33.2 20.91,56.5 v20.81,56.4 20.81,54.8 19.61,53.6 R24.2 18.41,53.6 Q3.S 16.1,51.3 15.2,51.3 v14.71,50.8 | 20.81,60.3 21.21,60.7 23.31,60.7 | I2C.GND 36.76,60.75 36.76,63.45 35.71,64.5 v34.91,64.5 33.91,65.5 v33.91,66.1 33.91,68.8 v34.21,69.1 | Q5.S 25.06,60.8 26.81,60.8 v28.11,59.5 28.61,60 v28.61,61 | v30.01,56.9 30.28,57.17 U$3.8 34.54,57.17 35.01,56.7 35.01,54.1 35.76,53.35 | 35.76,53.35 35.84,53.27 U$3.15 | C2.1 10.73,35.27 v10.51,35.5 | 10.16,31.75 10.91,31.75 v10.91,31.7 10.96,31.65 | v16.11,33.5 16.06,33.45 | 16.06,33.45 13.71,31.1 11.51,31.1 10.96,31.65 | v18.71,27.8 17.66,26.75 R36.1 | GPIO40.14 46.57,11.77 46.57,13.32 v46.47,13.42 | v13.81,45.1 13.41,45.5 13.41,46.5 v13.51,46.6 13.81,46.9 v14.71,46.9 14.71,48.8 v14.51,49
  Bottom 0.152: IC2.24 7.56,37.85 6.91,37.2 2.61,37.2 2.41,37 v2.41,36.9 | 23.31,60.7 23.11,60.9 v23.11,61.6 | C18.1 16.44,21.93 | 16.44,21.93 16.89,21.48 16.89,20.6 | 16.89,20.6 C17.1 | C16.1 R13.2 14.01,16.15 12.76,17.4 v12.31,17.4 11.71,17.4 | C16.1 14.11,13.25 C13.1 | 9.01,16.9 9.01,16.6 9.11,16.5 U7.7 11.5,16.5 11.56,16.55 | 9.01,16.9 9.01,17.4 | 9.01,17.4 9.01,17.9 9.1,18 U7.10 11.5,18 11.51,18 11.71,17.8 11.71,17.5 | 9.01,17.4 9.1,17.5 U7.9 11.71,17.5 | 9.01,16.9 10.18,16.9 U7.8 11.6,17 11.71,17.1 | 11.71,17.5 11.71,17.4 | 11.71,17.4 11.71,17.1 | 11.71,17.1 11.71,16.7 11.56,16.55 | C12.1 14.21,18.7 15.31,17.6 16.81,17.6 17.41,18.2 | 17.41,18.2 17.41,20.08 16.89,20.6 | C16.1 17.01,14.6 17.06,14.65 | 17.06,14.65 17.41,15 17.41,18.2 | R36.1 17.21,22.7 16.44,21.93 | 11.21,11.2 SPI-LED.GND 11.21,7.3 v11.51,7 11.51,4 v11.81,3.7 10.71,2.6 v10.44,2.6 11.54,1.5 v12.24,1.5 | 11.21,11.2 11.21,11.6 11.91,12.3 13.81,12.3 14.16,12.65 C13.1 | 8.96,14.35 8.91,14.4 8.91,15.7 9.2,16 U7.6 11.3,16 11.56,16.25 11.56,16.55 | 8.96,14.35 9.31,14 U7.2 | U7.14 9.11,20 9.01,20.1 9.01,20.3 9.06,20.35 | 9.06,20.35 9.2,20.5 U7.15 | 9.06,20.35 8.56,20.35 | 8.56,20.35 v8.51,20.4 | U7.23 12,24.5 12.31,24.8 14.11,24.8 14.51,25.2 14.51,27.7 15.01,28.2 16.71,28.2 17.21,27.7 R36.1 | GPIO40.9 40.87,6.86 39.41,5.4 38.91,5.4 38.56,5.05 38.56,3.35 | v16.11,37.5 v16.11,33.5 | v17.71,34.3 16.86,33.45 16.06,33.45 | 8.56,20.35 8.21,20 7.41,20 7.11,20.3 7.11,21.5 8.41,22.8 8.71,22.8 8.96,22.55 | 9.01,22.5 U7.19 | 8.96,22.55 9.01,22.5 | U7.18 9.21,22 9.01,22.2 9.01,22.5 | 8.96,22.55 8.96,23.25 9.21,23.5 U7.21 | 51.66,14.35 53.49,16.19 EXT1.1 53.61,15.2 v54.81,14
  Bottom 0.152: 51.66,14.35 v51.61,14.3 | R28.1 49.11,17.2 50.21,17.2 v50.41,17.4 51.66,16.15 51.66,14.35 | v13.71,43.2 12.01,43.2 11.11,44.1 v11.11,45.2 9.11,45.2 8.41,45.9 | v21.31,31.1 21.31,36 v21.41,36.1 21.41,36.5 20.91,37 20.91,37.6 21.01,37.7 21.01,38.2 v20.71,38.5 20.71,40 v20.81,40.1 | v29.71,39 31.11,37.6 v31.31,37.6 | v31.31,37.6 31.31,37.5 v29.31,35.5 29.31,36 v27.71,37.6 | v15.51,70.8 v18.51,67.8 | v18.51,67.8 21.31,70.6 v21.31,70.7 23.81,68.2 v23.81,67.7 | v23.81,67.7 24.71,68.6 v24.71,69.7 | v34.21,69.1 32.51,69.1 v31.01,67.6 v31.01,64.9 | v34.21,69.1 35.11,69.1 v36.71,67.5 36.81,67.5 38.11,68.8 v41.61,68.8 43.41,67 R9.1 R17.1 43.31,63 R45.1 R46.1 | v3.01,40 v2.01,41 0.81,42.2 0.81,44.4 1.21,44.8 1.61,44.8 2.76,43.65 6.96,43.65 | v3.37,27.39 v3.37,24.85 v3.37,22.31 v4.64,21.04 v3.37,19.77 v4.64,18.5 v3.37,17.23 v4.64,15.96 v3.37,14.69 v4.64,13.42 | U3.5 4.21,55.9 v3.61,55.3 | v6.41,58.5 7.41,59.5 v7.61,59.5 9.41,59.5 v10.11,58.8 | v11.51,60.4 10.21,61.7 v10.21,62.2 | v10.21,62.2 7.41,62.2 v7.31,62.3 | v10.21,62.2 10.51,62.5 13.91,62.5 15.31,63.9 v15.31,64.2 v17.01,65.9 18.51,67.4 v18.51,67.8 | v18.51,67.8 20.21,66.1 v21.01,66.1 | v23.81,67.7 25.71,65.8 v25.71,65.6 24.71,64.6 v24.11,64.6 | v4.64,5.8 v3.37,7.07 v2.1,8.34 v3.37,9.61 | v3.37,9.61 v4.64,10.88 v3.37,12.15 v4.64,13.42 | v3.37,9.61 v4.64,8.34 v5.91,7.07 | v4.64,13.42 5.24,14.02 v7.94,14.02 8.27,14.35 8.96,14.35 | v19.41,11.5 20.61,10.3 v21.01,10.3 | v21.71,6.3 22.11,5.9 22.11,5 22.71,4.4 v23.31,4.4 | v38.71,26.1 37.31,24.7 v35.91,24.7 35.91,26.12 v36.32,26.53 | v36.41,29.3 37.11,29.3 v38.41,30.6 36.31,32.7 v36.31,32.8
  Bottom 0.152: v37.91,38.5 38.11,38.7 v38.11,41.2 | v32.91,38.4 32.11,37.6 v31.31,37.6 | v31.31,37.6 32.51,36.4 v32.51,35.9 | v16.11,33.5 17.21,32.4 v17.51,32.4 16.81,31.7 v16.81,30.6 15.71,30.6 v15.01,29.9 14.61,29.5 v12.81,29.5 12.01,30.3 11.21,30.3 10.96,30.55 10.96,31.65 | v16.31,62 17.61,62 v18.21,62.6 18.21,63.7 v18.51,64 | v20.11,61.6 20.81,60.9 20.81,60.3 | v14.31,7.9 15.61,6.6 15.61,4.4 16.71,3.3 16.35,2.94 15.08,2.94 13.94,4.09 13.94,7.53 v14.31,7.9 | 29.01,3 v29.51,2.5 28.51,3.5 v28.51,4.8 | C13.1 15.91,13.2 v16.11,13 | 66.61,11.48 66.32,11.19 | 66.32,11.19 GPIO40.30 68.07,12.94 v68.71,12.94 | 66.32,11.19 66.32,11.59 65.61,12.3 65.11,12.3 63.96,13.45 63.96,14.55 R42.2 R41.2 | v7.21,54.5 8.51,55.8 v9.41,55.8 | v7.21,54.5 v8.51,53.2 | v14.31,7.9 14.21,8 14.21,11.44 13.91,11.73 12.5,11.73 11.97,11.2 11.21,11.2 | v17.51,14.1 17.06,14.55 17.06,14.65 | EXT2.1 56.54,1.8 v54.95,1.8 | GPIO40.25 59.89,9.9 54.81,9.9 GPIO40.20 | v62.97,2.04 64.67,2.04 65.91,0.8 73.16,0.8 MOTOR.1 | v49.76,7.34 49.71,7.29 49.71,5.1 49.31,4.7 48.01,4.7 47.41,4.1 GP13.GND 44.87,3.32 v44.85,3.34 | v64.67,4.8 67.77,4.8 v69.17,6.2 69.57,6.6 72.61,6.6 73.21,6 73.21,4.4 74.11,3.5 74.66,3.5 MOTOR.1 | v68.87,1.7 71.47,1.7 v72.77,3 75.16,3 MOTOR.1 | v37.05,4.04 37.87,4.04 38.56,3.35 | 38.56,3.35 GP12.GND | v29.81,5.8 30.61,6.6 v31.31,6.6 | ESC_CON.1 70.36,16.15 71.51,15 71.91,15 73.11,13.8 73.11,13.4 72.35,12.64 70.41,12.64 v70.21,12.84 70.21,12.28 GPIO40.34 | R46.1 42.11,58.5 v41.51,58.5 41.21,58.2 40.31,58.2 39.83,57.72 C7.1 39.83,56.48 C6.1 40.42,55.63 40.42,54.51 40.31,54.4 IC1.2 40.41,51.7 40.41,50.81 40.77,50.44 C8.1 40.92,50.23 40.92,48.61 40.61,48.3 v40.11,48.3
  Bottom 0.152: R46.1 43.41,59.6 43.41,58.9 42.81,58.3 42.81,57 43.31,56.5 v43.31,49.4 | C5.1 35.76,52.18 35.76,53.35 | GPIO40.39 81.15,6.42 | 81.15,6.42 81.37,6.2 v81.51,6.2 | v37.28,17.25 40.72,17.25 v41.87,18.4 | v30.09,13.81 30.05,13.77 | 30.05,13.77 29.21,12.93 v29.21,12.2 | v28.82,17.19 29.53,16.48 29.53,14.29 30.05,13.77 | v79.39,6.36 79.82,5.93 80.66,5.93 81.15,6.42 | v42.08,12.89 42.23,13.03 43.17,13.03 43.95,13.81 v44.07,13.81 | 51.66,14.35 52.11,13.9 v53.31,13.9 54.71,13.9 v54.81,14 | v54.81,14 54.81,14.1 | v54.81,14 55.21,14.4 v57.21,14.4 | v79.81,12.9 79.21,12.9 78.91,13.2 77.21,13.2 v76.41,14
  pour Bottom (rank 6): -18.99,100.5 94.21,100.5 94.21,-1.5 -18.99,-1.5
  pour Top (rank 6): -19.19,101 94.81,101 94.81,-2.9 -19.19,-2.9
GPIO4  (via drill 0.35)
  Top 0.152: EXT1.3 56.44,14.9 52.31,14.9 50.91,16.3 49.71,16.3 47.81,14.4 45.61,14.4 v45.41,14.2 | R39.2 R40.1 37.91,8.18 GPIO40.7
  Bottom 0.152: v45.41,14.2 45.41,13.3 44.61,12.51 42.96,12.51 42.53,12.08 41.88,12.08 41.36,12.6 40.31,12.6 39.61,11.9 39.61,9.88 GPIO40.7
GPIO12  (via drill 0.35)
  Top 0.152: v48.21,1.8 53.91,1.8 56.61,4.5 61.01,4.5 v61.41,4.9 | v66.91,6.3 67.51,6.9 67.51,9.84 GPIO40.32
  Bottom 0.152: R43.2 42.41,3.5 GP12.I/O 43.61,3.3 45.31,1.6 48.01,1.6 v48.21,1.8 | v61.41,4.9 62.81,6.3 v66.91,6.3
GPIO13
  Bottom 0.152: GPIO40.33 71.35,8.04 70.51,7.2 69.11,7.2 68.71,6.8 67.81,6.8 67.61,7 62.41,7 61.91,6.5 60.21,6.5 59.51,7.2 57.71,7.2 57.01,6.5 55.51,6.5 55.21,6.8 52.71,6.8 52.11,6.2 R44.2 52.51,5 53.41,4.1 GP13.IO
GPIO18
  Bottom 0.152: GPIO40.12 43.41,10.8 44.31,9.9 46.71,9.9 47.21,10.4 47.21,11.9 48.11,12.8 48.31,12.8 48.61,13.1 R30.1
GPIO19  (via drill 0.35)
  Top 0.152: GPIO40.35 72.71,9.78 72.71,13.4 72.51,13.6 v72.11,13.6
  Bottom 0.152: R38.1 71.61,14.1 v72.11,13.6
GPIO20
  Top 0.152: EXT1.6 63.61,15.3 64.21,14.7 67.61,14.7 68.41,13.9 71.01,13.9 71.46,14.35 arc-32 71.91,14.6 arc-26 72.51,14.6 arc63 73.11,14.8 arc27 73.21,15 arc-112 73.61,15.16 arc-74 73.91,14.77 73.91,12.8 arc180 74.71,12.8 74.71,14.7 arc-180 75.51,14.7 75.51,12.6 75.61,12.5 arc-28 GPIO40.38
  Bottom 0.152: EXT1.6 63.48,16.07 62.41,15 R42.1
GPIO21  (via drill 0.35)
  Top 0.152: v75.61,18.2 78.07,18.2 79.92,16.34 arc-119 79.81,15.9 arc41 78.31,14.8 arc125 78.71,14.1 arc-33 79.51,13.9 arc-147 79.41,13.5 arc8 78.51,13.4 arc123 78.31,12.8 arc51 78.81,12.6 arc-97 79.01,12.4 arc3 GPIO40.40
  Bottom 0.152: v75.61,18.2 R18.1
GPIO22  (via drill 0.35)
  Top 0.152: R61.1 49.56,12.45 v49.81,12.2
  Bottom 0.152: v49.81,12.2 49.81,9.92 GPIO40.15
GPIO23  (via drill 0.35)
  Top 0.152: EXT2.4 64.01,1.7 63.31,1 46.81,1 45.81,2 v45.81,4.7 45.81,4.6 | v47.21,7.5 v46.21,6.5
  Bottom 0.152: v45.81,4.7 45.81,6.1 v46.21,6.5 | v47.21,7.5 47.21,9.4 48.49,10.68 GPIO40.16
GPIO24  (via drill 0.35)
  Top 0.152: GPIO40.18 52.27,9.9 54.41,9.9 54.81,9.5 54.81,7.7 55.51,7 57.21,7 v57.91,6.31
  Bottom 0.152: EXT2.3 58.97,6.31 v57.91,6.31
GPIO25  (via drill 0.35)
  Top 0.152: EXT2.7 70.01,4.4 69.11,5.3 66.41,5.3 65.01,6.7 v65.01,7.76 | v60.51,12.8 59.91,12.2 59.91,10.2 59.61,9.9 56.61,9.9 56.11,10.4 GPIO40.22
  Bottom 0.152: v65.01,7.76 65.01,9.6 64.71,9.9 63.01,9.9 62.51,10.4 62.51,12.2 61.91,12.8 v60.51,12.8
GPIO26
  Top 0.152: EXT2.6 68.01,1.5 68.71,0.8 73.21,0.8 73.61,1.2 73.61,3.6 73.11,4.1 73.11,5 73.41,5.3 74.91,5.3 75.11,5.5 75.11,5.8 74.91,6 73.21,6 72.91,6.3 72.91,6.7 73.11,6.9 75.71,6.9 76.43,7.62 GPIO40.37
GPIO27  (via drill 0.35)
  Top 0.152: EXT2.5 66.01,4.6 64.86,5.75 55.66,5.75 54.91,6.5 51.31,6.5 50.41,5.6 v48.71,5.6
  Bottom 0.152: v48.71,5.6 48.21,5.6 45.95,7.86 GPIO40.13
LED0
  Bottom 0.152: IC2.6 6.91,33.6 7.31,34 10.31,34 12.21,32.1 13.61,32.1 14.91,33.4 14.91,39.5 15.61,40.2 R2.1
LED1
  Bottom 0.152: IC2.7 6.26,34.05 6.81,34.6 10.41,34.6 12.41,32.6 13.21,32.6 14.21,33.6 14.21,39.7 14.61,40.1 14.61,43.4 14.91,43.7 R4.1
MOSI1
  Top 0.152: R10.1 22.51,32.4 22.61,32.4 U2.P$25
  Top 1.27: U2.P$11 22.61,32.4
MOSI2  (via drill 0.35)
  Top 0.152: v17.31,12.3 17.31,13.2 16.21,14.3 16.21,27.55 13.28,30.48 10.73,30.48 8.81,32.4 8.81,35.2 9.95,36.34 LED1.SDO
  Bottom 0.152: SPI-LED.DI 17.21,12.2 v17.31,12.3
MOSI_HV
  Top 0.152: U$9.4 11.64,36.45 LED1.SDI
MOSI_LV
  Top 0.152: R10.2 16.96,35.65 16.81,35.8 U$9.2
MOTORCONTROLPOWER  (via drill 0.35)
  Top 0.152: MOTOR.6 80.71,4.95 80.71,14.19 v79.85,15.04
  Bottom 0.152: v79.85,15.04 78.69,16.2 ESC_CON.6 | MOTOR.6 82.81,2.85 82.81,1.01 82.6,0.8 79.21,0.8 | R59.2 79.24,0.83 79.21,0.8 | R57.2 75.2,1.01 75.41,0.8 77.41,0.8 | 77.41,0.8 79.21,0.8 | R58.2 77.21,1 77.41,0.8
N$3
  Bottom 0.152: C22.2 11.55,27.5 U7.29
N$4
  Bottom 0.152: U$3.10 37.93,56.52 38.61,57.2 38.61,57.7 40.61,59.7 R46.2
N$5  (via drill 0.35)
  Top 0.152: v11.91,58.7 12.41,58.7 18.81,52.3 32.41,52.3 v35.41,49.3 | U2.P$1 38.23,24.78 37.31,25.7 37.31,36.4 35.61,38.1 v35.61,39.1
  Top 1.27: U2.P$1 U2.P$15
  Bottom 0.152: v35.41,49.3 35.41,39.3 v35.61,39.1 | v11.91,58.7 10.21,60.4 6.71,60.4 5.44,59.14 U3.7
N$6
  Bottom 0.152: U1.2 12.4,52.72 12.85,53.16 R26.1
N$7
  Bottom 0.152: IC2.23 6.86,38.67 R3.2
N$8  (via drill 0.35)
  Top 0.152: v11.21,57.5 17.61,51.1 32.01,51.1 v33.71,49.4
  Top 1.27: U2.P$2 U2.P$16
  Bottom 0.152: U2.P$2 36.99,27.32 35.31,29 35.31,33.9 33.71,35.5 v33.71,49.4 | U3.6 5.44,57.87 6.51,56.8 8.71,56.8 9.41,57.5 v11.21,57.5
N$9
  Bottom 0.152: R15.1 14.88,56.52 U3.4
N$10
  Bottom 0.152: IC2.21 5.61,39.96 TP2.TP
N$11  (via drill 0.35)
  Top 0.152: U$13.4 36.91,13.12 37.48,12.55 v37.45,12.53
  Bottom 0.152: v37.45,12.53 38.18,12.53 38.48,12.82 R60.1
N$12
  Bottom 0.152: R16.1 14.87,60.47 U3.1
N$13
  Top 0.152: U$13.10 38.94,15.59 39.55,16.2 TP3.TP
N$14
  Bottom 0.152: R13.1 11.85,15.5 U7.5
N$15
  Top 0.152: U$13.9 39.06,15.09 39.33,15.36 40.72,15.36 40.97,15.61 40.97,16.12 41.4,16.55 C20.2
N$16
  Bottom 0.152: U7.27 11.41,26.5 11.61,26.7 13.31,26.7 13.58,26.43 C19.2
N$17
  Bottom 0.152: U7.3 11.11,14.5 11.41,14.2 11.41,13.7 11.91,13.2 C13.2
N$18
  Bottom 0.152: U7.17 11.89,21.5 R31.2
N$19
  Bottom 0.152: U$3.11 36.34,55.87 36.21,56 36.21,57.6 36.71,58.1 38.21,58.1 40.91,60.8 41.41,60.8 R45.2
N$21
  Bottom 0.152: C19.1 11.81,26 U7.26
N$22
  Bottom 0.152: U7.28 11.41,27 11.51,27.1 13.41,27.1 13.61,27.3 C22.1
N$23
  Bottom 0.152: R24.1 18.11,55.2 Q3.G 17.06,54.85 16.41,54.2 16.41,53 15.51,52.1 12.81,52.1 12.41,51.7 9.11,51.7 7.11,49.7 2.61,49.7 2.36,49.45 R8.1
N$24
  Top 0.152: RCPWR.CATHODE 4.81,38.1 R7.2
N$25
  Bottom 0.152: U7.4 11.21,15 11.61,14.6 C16.2
N$26
  Bottom 0.152: Q3.D 15.46,54.25 14.95,54.76 R26.2
N$27
  Bottom 0.152: 21.66,62.25 Q4.D 21.61,62.05 R27.2
N$28
  Bottom 0.152: U3.3 18.27,57.87 19.11,58.7 19.11,62.7 19.81,63.4 R27.1
N$29
  Bottom 0.152: Q5.D 24.91,63.2 R29.2
N$30
  Bottom 0.152: U3.2 13.07,59.14 12.41,59.8 12.41,61.2 13.21,62 14.91,62 16.91,64 16.91,64.4 17.81,65.3 22.21,65.3 23.42,64.09 R29.1
N$31
  Bottom 0.152: R17.2 41.31,63.1 40.91,62.7 40.91,61.6 37.91,58.6 36.21,58.6 35.81,58.2 35.81,55.3 36.54,54.57 U$3.13
N$32
  Bottom 0.152: D1.ANODE 15.91,15.9 14.31,17.5 13.46,17.5 C12.2 12.26,19.75 R25.2 12.61,20.6 12.61,20.7 12.81,20.9 13.11,20.9 13.58,21.38 R31.1
N$33
  Bottom 0.152: R34.2 25.71,57.96 R32.1 25.86,58.7 Q5.G
N$34
  Top 0.152: U$13.27 33.5,14.59 X1.1 31.89,14.8 C21.1
N$35
  Bottom 0.152: U$3.14 36.39,53.92 35.41,54.9 35.41,58.6 35.81,59 37.71,59 40.41,61.7 40.41,63.3 41.61,64.5 R9.2
N$36
  Top 0.152: U$13.26 34.69,15.09 34.48,15.3 34.48,16.77 33.95,17.3 X1.2 32.99,17 C23.1
N$37  (via drill 0.35)
  Top 0.152: v8.46,21.7 8.51,21.74 8.51,22.9 9.81,24.2 14.21,24.2 v14.41,24
  Bottom 0.152: R36.2 15.21,25.8 R37.1 15.66,25.25 v14.41,24 | U7.16 9.17,21 v8.46,21.7
N$38
  Bottom 0.152: Q4.G 22.51,59.6 R33.1 R35.2
N$40
  Bottom 0.152: C6.2 39.36,55.35 IC1.4
N$41  (via drill 0.35)
  Top 0.152: v8.21,37.1 7.93,36.83 R1.2
  Bottom 0.152: U$11.#3 8.23,40.87 C3.2 8.23,38.64 IC2.25 v8.21,37.1
N$42
  Top 0.152: U$13.7 39.33,14.09 39.75,14.51 42.74,14.51 43.36,15.13 TP4.TP
N$43
  Top 0.152: U$13.6 39.79,13.59 R54.2
N$44
  Top 0.152: U$13.5 37.41,13.48 37.77,13.12 39.86,13.12 R53.2
N$45
  Top 0.152: U$13.17 36.91,18.4 37.16,18.65 38.85,18.65 38.91,18.6 R55.2 40.2,18 41.21,18 41.51,17.7 42.56,17.7 R62.1
N$46
  Top 0.152: U$13.8 39.23,14.59 39.6,14.96 41.49,14.96 TP5.TP
N$50
  Bottom 0.152: R19.2 11.9,23 U7.20
NC5
  Top 1.27: U2.P$10 U2.P$24
NC_MS1
  Top 0.152: MOTOR.5 77.71,6.45 77.71,12.1 77.26,12.55 77.26,14.55 76.36,15.45 ESC_CON.5
  Bottom 0.152: TP1.TP 77.6,14.35 76.36,15.59 ESC_CON.5
PCH1  (via drill 0.35)
  Top 0.152: U$1.7:SIGNAL1 17.53,44.98 v16.51,46
  Bottom 0.152: v16.51,46 16.48,46 15.86,46.62 R12.1
PCH2  (via drill 0.35)
  Top 0.152: U$1.4:SIGNAL2 v9.91,46.1
  Bottom 0.152: R11.1 v9.91,46.1
PCH3_XAIO  (via drill 0.35)
  Top 0.152: v35.31,35.8 34.31,35.8 31.61,38.5 v31.61,39.8 | v23.81,45.7 22.01,45.7 21.61,45.3 21.61,41.7 20.91,41 20.51,41 19.81,40.3 17.71,40.3 16.5,41.51 10.91,41.51 9.21,39.8 9.21,38.5 8.91,38.2 6.81,38.2 6.01,39 6.01,45.5 v6.11,45.6 | v5.01,48.8 5.01,52.8 v5.31,53.1
  Top 1.27: U2.P$3 U2.P$17
  Bottom 0.152: R6.1 3.71,52.56 3.78,52.63 | 3.78,52.63 U1.3 | U2.P$3 35.31,35.19 v35.31,35.8 | v31.61,39.8 25.71,45.7 v23.81,45.7 | v6.11,45.6 5.01,46.7 v5.01,48.8 | v5.31,53.1 4.83,52.63 3.78,52.63
PCH_3  (via drill 0.35)
  Top 0.152: U$1.1:SIGNAL3 2.29,45.82 v2.21,45.9
  Bottom 0.152: v2.21,45.9 2.21,47 R8.2
RC_CH1_ST  (via drill 0.35)
  Top 0.152: U$1.11:ST_SIGNAL 27.69,45.98 v27.71,46
  Bottom 0.152: v27.71,46 27.71,47.1 R20.2
RC_CH2_TH  (via drill 0.35)
  Top 0.152: U$1.15:TH_SINGNAL 37.85,45.86 v37.81,45.9
  Bottom 0.152: v37.81,45.9 37.78,45.93 R21.2
RCH1
  Bottom 0.152: R20.1 27.73,52.53 29.81,54.6 31.47,54.6 U$3.4
RCH2
  Bottom 0.152: R21.1 37.78,48.62 35.01,51.39 35.01,53.2 34.51,53.7 34.51,56.2 34.19,56.52 U$3.7
RECV_CH1  (via drill 0.35)
  Top 0.152: v29.71,53.3 29.61,53.2 24.71,53.2 v24.61,53.3 | v23.81,55.1 23.81,55 v22.21,53.4
  Bottom 0.152: v24.61,53.3 22.31,53.3 v22.21,53.4 21.51,53.4 18.21,50.1 16.41,50.1 15.86,49.55 R12.2 | v29.71,53.3 29.81,53.2 31.43,53.2 U$3.2 | R34.1 24.57,55.87 v23.81,55.1
RECV_CH2  (via drill 0.35)
  Top 0.152: v27.91,54.2 25.81,54.2 25.41,54.6 25.41,56.3 24.61,57.1 24.01,57.1 v23.71,56.8
  Bottom 0.152: R11.2 9.91,50 10.63,50.72 11.59,50.72 12.41,49.9 15.11,49.9 15.93,50.72 17.98,50.72 22.51,55.25 R35.1 22.86,55.85 23.71,56.7 v23.71,56.8 | U$3.5 29.11,55.22 29.01,55.12 | 29.01,55.12 29,55.12 | 29.01,55.12 28.09,54.2 v27.91,54.2
SCK1
  Top 0.152: R14.1 22.84,37.5
  Top 1.27: U2.P$9 U2.P$23 22.84,37.5
SCL  (via drill 0.35)
  Top 0.152: v30.81,59.4 32.31,57.9 33.91,57.9 37.01,61 37.01,64.6 36.91,64.7 | 36.91,64.7 33.11,68.5 15.01,68.5 2.71,56.2 2.71,47.49 3.23,46.97 3.23,41.31 2.01,40.09 2.01,38.6 3.21,37.4 3.21,36.5 3.06,36.36 v3.06,34.3 3.11,34.26 v3.11,29.9 | v15.31,3.5 16.31,2.5 27.81,2.5 28.71,1.6 29.61,1.6 29.91,1.9 v32.11,1.9 | v7.31,18.1 6.91,17.7 6.91,13.6 7.61,12.9 8.71,12.9 12.71,8.9 12.71,7.4 13.91,6.2 14.51,6.2 v14.61,6.3 | 36.91,64.7 36.91,65 39.71,67.8 42.31,67.8 43.81,66.3 v43.81,57.4 | U$13.19 35.91,16.31 36.07,16.15 36.07,15.55 36.39,15.23 v36.39,15.03
  Top 1.27: U2.P$6 U2.P$20
  Bottom 0.152: I2C.SCL 30.16,60.05 v30.81,59.4 | v32.11,1.9 33.91,1.9 35.53,3.52 R22.1 35.58,8.4 GPIO40.5 37.05,9.86 37.05,11.93 36.28,12.7 36.28,14.91 v36.39,15.03 | IC2.26 8.86,36.26 8.41,35.81 4.57,35.81 v3.06,34.3 | v15.31,3.5 14.61,4.2 v14.61,6.3 | U7.13 8.7,19.5 v7.31,18.1 6.51,18.9 6.51,21.6 4.61,23.5 4.61,28.4 v3.11,29.9 | U2.P$6 39.33,37.48 39.11,37.7 39.11,41.8 41.81,44.5 41.81,45.8 41.71,45.9 41.71,46.2 44.3,48.79 44.3,56.91 v43.81,57.4
SDA  (via drill 0.35)
  Top 0.152: U2.P$5 40.44,34.94 | v33.61,55 33.61,55.3 32.81,56.1 29.51,56.1 25.91,59.7 25.91,63.9 28.11,66.1 | 28.11,66.1 v32.01,66.1 | v31.51,3.9 31.11,3.5 17.71,3.5 v17.21,4 | 28.11,66.1 27.31,66.9 16.51,66.9 3.89,54.28 3.89,35.2 v4.79,34.3 4.41,33.92 v4.41,29.8 | v16.31,7 8.21,15.1 v8.21,15.9 8.21,19.3 7.41,20.1 v7.41,23 | U$13.20 34.99,18.19 32.11,18.19 31.68,18.62 30.44,18.62 29.72,17.9 29.72,14.49 29.32,14.09 29.32,13.26 29.9,12.68 31.8,12.68 32.04,12.44 32.04,9.49 32.93,8.6 GPIO40.3
  Top 1.27: U2.P$5 U2.P$19
  Bottom 0.152: v32.01,66.1 32.16,65.95 I2C.SDA | GPIO40.3 32.24,7.59 32.24,5.35 R23.1 32.54,4.93 v31.51,3.9 | IC2.27 9.51,35.9 8.71,35.1 5.59,35.1 v4.79,34.3 | U7.12 11.31,19 11.41,18.9 11.41,18.6 11.3,18.5 U7.11 8.9,18.5 8.21,17.8 v8.21,15.9 | v17.21,4 16.31,4.9 v16.31,7 | v7.41,23 7.41,23.2 5.41,25.2 5.41,28.8 v4.41,29.8 | U2.P$5 39.11,36.47 39.11,36.5 38.51,37.1 37.81,37.1 36.71,38.2 36.71,38.9 37.11,39.3 37.11,39.9 36.61,40.4 36.61,49.1 34.21,51.5 34.21,53.2 33.61,53.8 v33.61,55
SENSE1_ESC  (via drill 0.35)
  Top 0.152: ESC_CON.2 71.86,17.25 69.61,19.49 26.52,19.49 25.51,20.51 v25.51,20.6 | R47.1 36.01,40.6 33.21,40.6 v32.91,40.3
  Bottom 0.152: R50.2 75.01,7.5 75.21,7.7 75.21,11.9 74.01,13.1 74.01,13.9 71.86,16.05 ESC_CON.2 | v25.51,20.6 24.11,22 24.11,38.4 24.41,38.7 28.11,38.7 29.81,40.4 29.91,40.4 31.51,38.8 32.11,38.8 32.91,39.6 v32.91,40.3
SENSE1_MOTOR
  Bottom 0.152: R50.1 76.61,3.05 MOTOR.2 76.3,2.44 R57.1
SENSE2_ESC  (via drill 0.35)
  Top 0.152: ESC_CON.3 73.36,18.55 v73.01,18.9 | v24.21,20.2 23.31,20.2 v21.11,22.4
  Bottom 0.152: R51.2 77.71,4.6 77.71,12.2 77.31,12.6 76.01,12.6 75.81,12.8 75.81,13.06 73.36,15.51 ESC_CON.3 | v73.01,18.9 72.21,18.9 71.91,19.2 25.79,19.2 24.79,20.2 v24.21,20.2 | R48.1 21.81,42.3 19.91,40.4 19.91,38.1 20.51,37.5 20.51,23 v21.11,22.4
SENSE2_MOTOR
  Bottom 0.152: R51.1 78.26,3.55 MOTOR.3 78.31,2.85 R58.1
SENSE3_ESC
  Bottom 0.152: ESC_CON.4 76.26,17.6 76.54,17.6 77.13,18.2 | R52.2 82.41,5 82.41,6.4 80.71,8.1 80.71,15.55 79.01,17.25 78.08,17.25 77.13,18.2 | R49.1 77.13,18.2
SENSE3_MOTOR
  Bottom 0.152: R52.1 80.31,4 79.76,3.45 MOTOR.4 80.34,2.32 R59.1
SENSOR1
  Top 0.152: R47.2 38.43,40.02 U2.P$7
  Top 1.27: U2.P$7 U2.P$21
SENSOR2
  Top 1.27: U2.P$8 U2.P$22
  Bottom 0.152: 25.82,39.6 U2.P$8 25.4,41.91 25.01,42.3 R48.2
SENSOR3
  Bottom 0.152: R49.2 80.7,18.25 S3.1
SIGNAL_SELCET
  Top 1.27: U2.P$4 U2.P$18
  Bottom 0.152: R5.2 29.71,52 30.33,52.62 U$3.1 32.19,52.62 34.61,50.2 34.61,38.43 U2.P$4

## Text on the board
tPlace: ch | 3 | ch | 2 | ch | 1 | ST | TH | Not connect | Not connect | VCC | VCC | VCC | VCC | VCC | SIGNAL | SIGNAL | SIGNAL | SIGNAL | SIGNAL | D0 | ESC_SIDE | #612 | R 3.0.4 | 2 | 20 | 30 | 40 | 1 | 9 | 19 | 29 | MOTOR_SIDE
bPlace: SCL | SDA | GND | 5V | S/N | 3V3 | GND | 5V | G | 5V | 4 | 19 | 18 | 20 | 21 | S2 | Rev 3.0.4 | G | P | S1 | S3 | MOSI | GND | CLK | F-612-3-0-4-A-N-J-0-PCBW | 5V | G | G | 5V | 12 | G | 5V | 3V | 13 | G | 5V | 24 | 23 | 27 | 26 | 25
Document: Jetson Nano DevKit / B-01 (A02) | #612 JetRacer Rev 3.0.4 / 2024/06/06 1903
_tNames: I2C-CON | Jetson Nano Border | TLP2270 | MC74VHC157 | TLP291 | LP2985-33DBVR | CUS05F40 | KC2016Z(25MHz,OSC) | Fusion Sensor / BNO055 | Not Used | PCA9685PW | XIAO ESP32S3 | AP102-202 | brushless motor Sensor / ESC side | 0.96inchOLED(Blue) | Expansion / I2S Connector and e.t.c | FC-135 12.5p | Jetson Orin Nano / Users Hole | SPI-LED CON | Expansion / GPIO or jetson pwm | Expansion / SPI Connector and e.t.c | brushless motor Sensor / MotorSide